# EAGLE schematic Vector Board_Bench 5_04062026 (EAGLE 9.7.0)
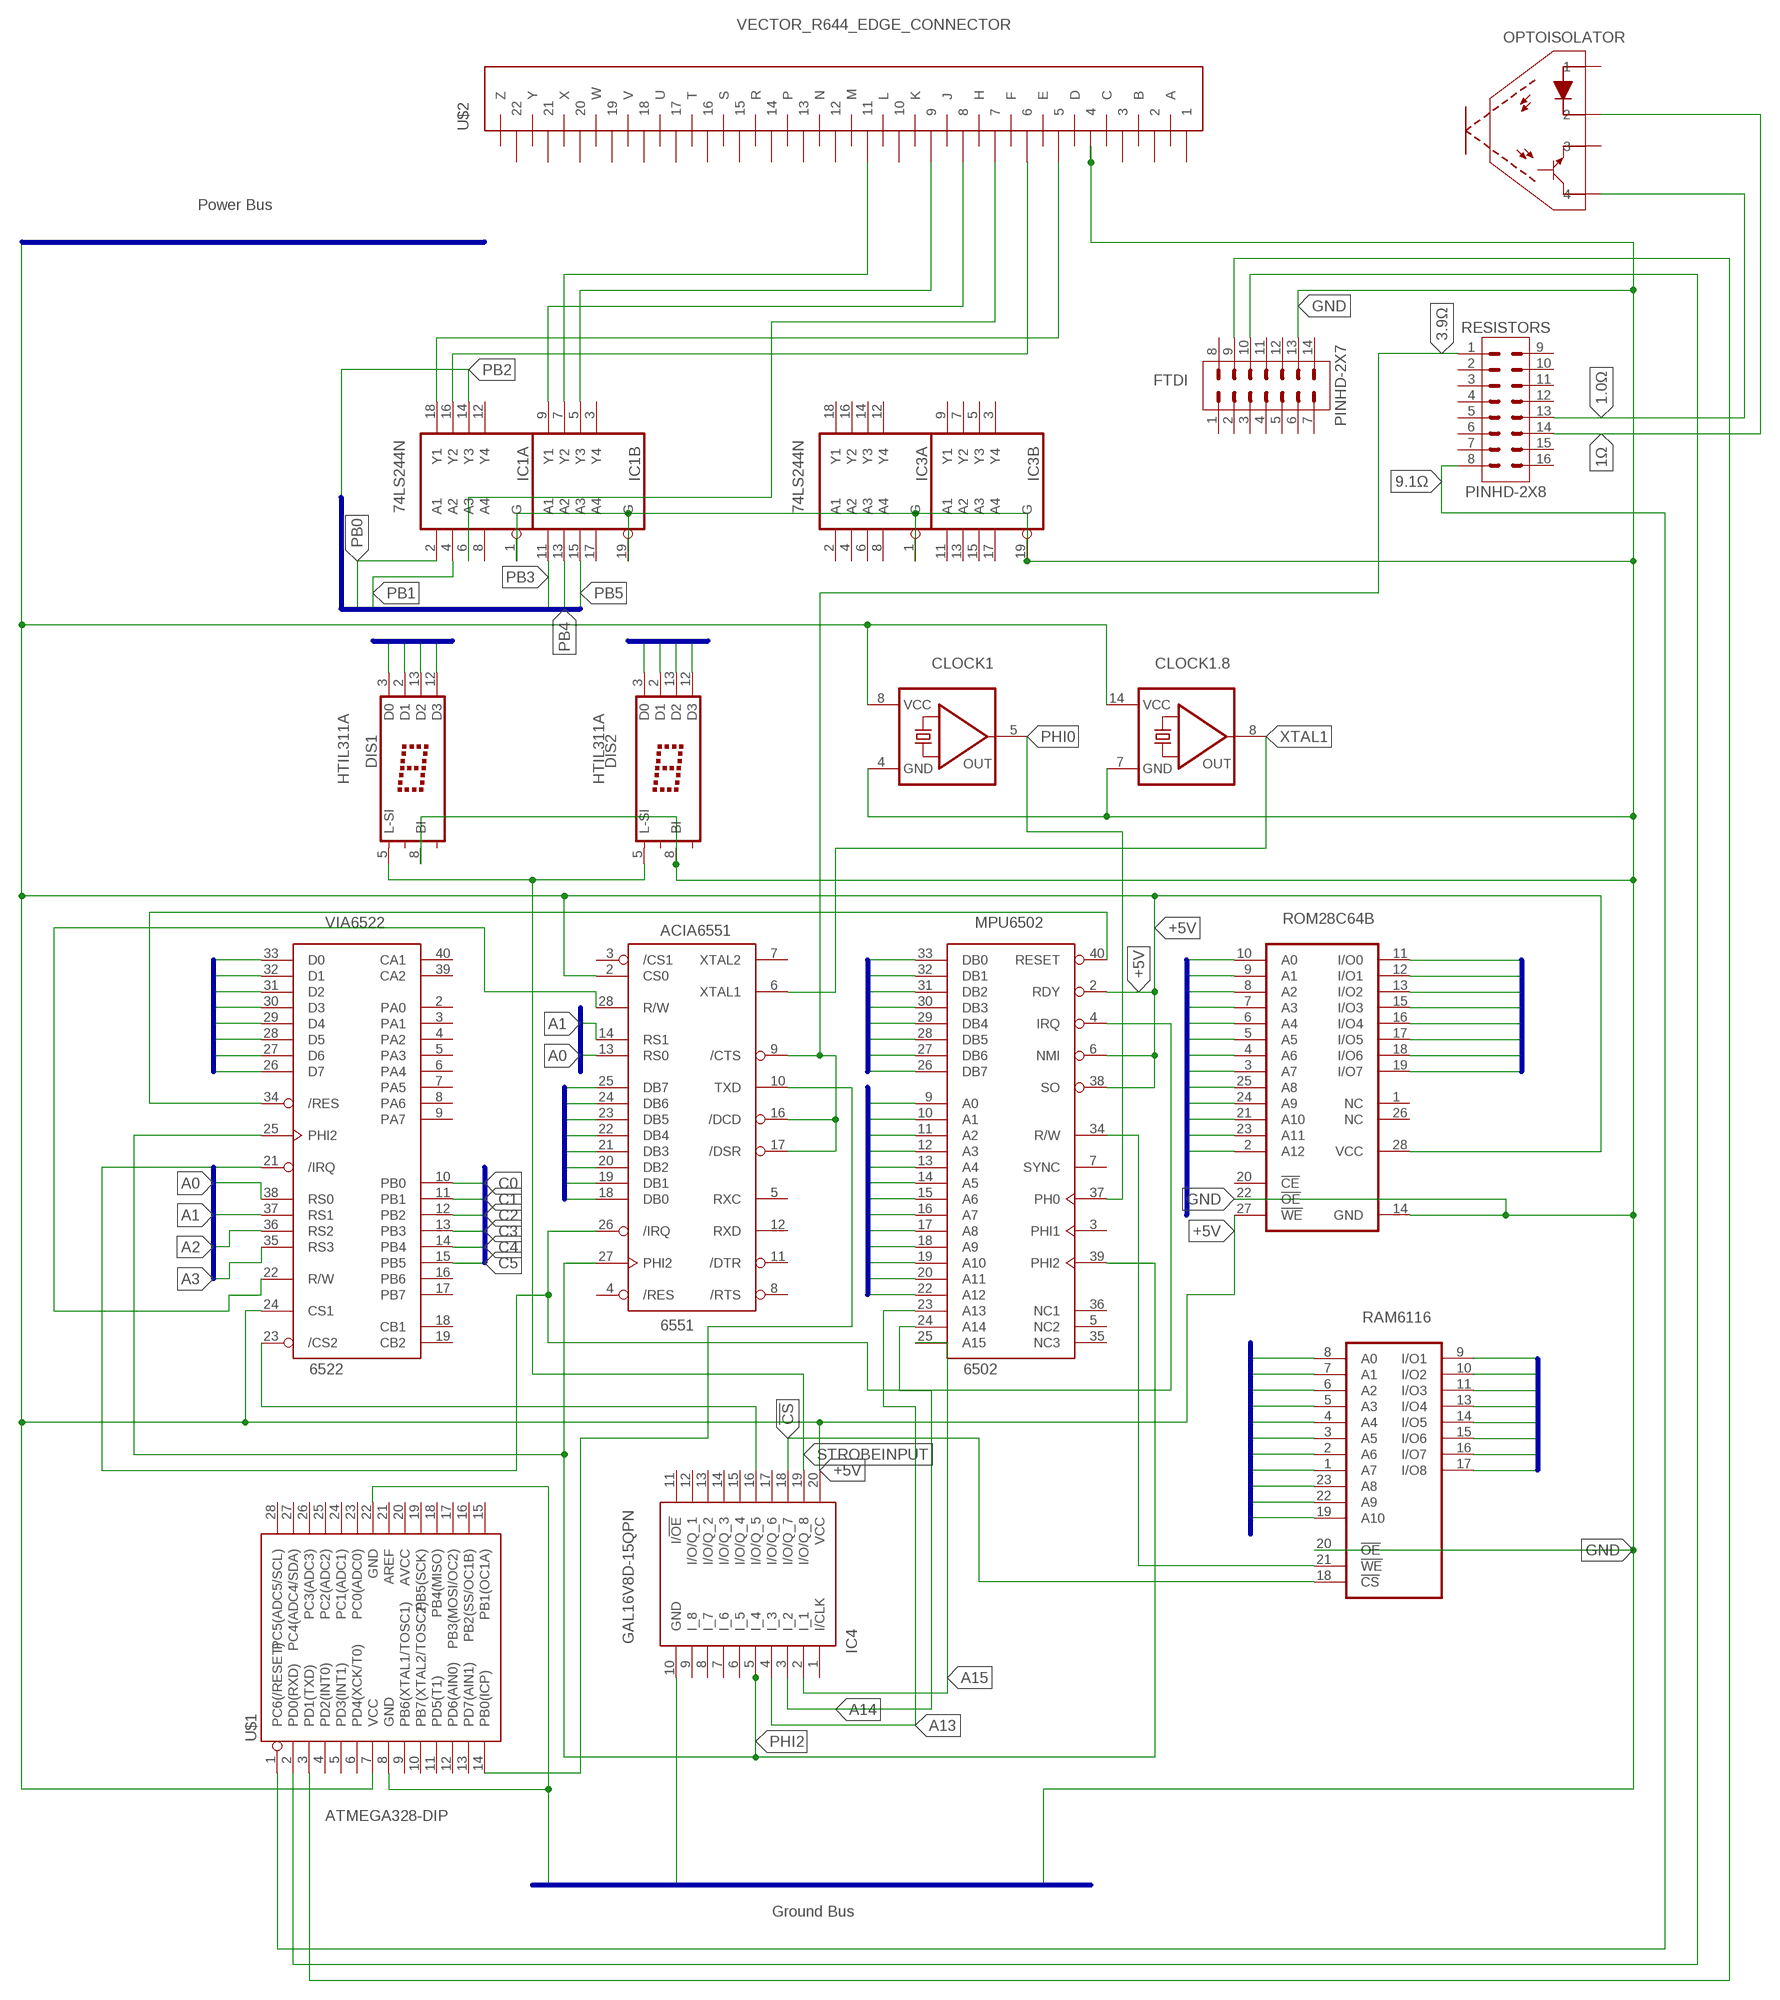
[diagram p0: schematic, sheet 1]

## Parts
ACIA6551  6551  [DIP28]
CLOCK1  QG5460  [DIL08S]
CLOCK1.8  QG5860  [DIL14S]
DIS1  HTIL311A  [HTIL311A]
DIS2  HTIL311A  [HTIL311A]
FTDI  PINHD-2X7  [2X07]
IC1  74LS244N  [DIL20]
IC3  74LS244N  [DIL20]
IC4  GAL16V8D-15QPN  [DIP794W56P254L2591H533Q20N]
MPU6502  6502  [DIP40]
OPTOISOLATOR  OPB7XX_OPTICAL  [OPB7XX_OPTICAL]
RAM6116  6116P  [DIL24-6]
RESISTORS  PINHD-2X8  [2X08]
ROM28C64B  28C64C  [DIL28-6]
U$1  ATMEGA328-DIP  [DIP28]
U$2  VECTOR_R644_EDGE_CONNECTOR  [VECTOR44]
VIA6522  6522  [DIP40]

## Nets
1.0Ω: OPTOISOLATOR.P$4 RESISTORS.13
1Ω: OPTOISOLATOR.P$2 RESISTORS.14
3.9Ω: ACIA6551.9(/CTS) ACIA6551.16(/DCD) ACIA6551.17(/DSR) RESISTORS.1
9.1Ω: RESISTORS.8 U$1.1(PC6(/RESET))
!CS: IC4.18(I/O/Q_7) RAM6116.18(!CS)
+5V: ACIA6551.2(CS0) CLOCK1.8(VCC) CLOCK1.8.14(VCC) IC4.20(VCC) MPU6502.2(RDY) MPU6502.6(NMI) MPU6502.38(SO) ROM28C64B.27(!WE) ROM28C64B.28(VCC) U$1.7(VCC) VIA6522.24(CS1)
A0: ACIA6551.13(RS0) MPU6502.9(A0) RAM6116.8(A0) ROM28C64B.10(A0) VIA6522.38(RS0)
A1: ACIA6551.14(RS1) MPU6502.10(A1) RAM6116.7(A1) ROM28C64B.9(A1) VIA6522.37(RS1)
A2: MPU6502.11(A2) RAM6116.6(A2) ROM28C64B.8(A2) VIA6522.36(RS2)
A3: MPU6502.12(A3) RAM6116.5(A3) ROM28C64B.7(A3) VIA6522.35(RS3)
A4: MPU6502.13(A4) RAM6116.4(A4) ROM28C64B.6(A4)
A5: MPU6502.14(A5) RAM6116.3(A5) ROM28C64B.5(A5)
A6: MPU6502.15(A6) RAM6116.2(A6) ROM28C64B.4(A6)
A7: MPU6502.16(A7) RAM6116.1(A7) ROM28C64B.3(A7)
A8: MPU6502.17(A8) RAM6116.23(A8) ROM28C64B.25(A8)
A9: MPU6502.18(A9) RAM6116.22(A9) ROM28C64B.24(A9)
A10: MPU6502.19(A10) RAM6116.19(A10) ROM28C64B.21(A10)
A11: MPU6502.20(A11) ROM28C64B.23(A11)
A12: MPU6502.22(A12) ROM28C64B.2(A12)
A13: IC4.4(I_3) MPU6502.23(A13)
A14: IC4.3(I_2) MPU6502.24(A14)
A15: IC4.2(I_1) MPU6502.25(A15)
C0: VIA6522.10(PB0)
C1: VIA6522.11(PB1)
C2: VIA6522.12(PB2)
C3: VIA6522.13(PB3)
C4: VIA6522.14(PB4)
C5: VIA6522.15(PB5)
D0: ACIA6551.18(DB0) DIS1.3(D0) MPU6502.33(DB0) RAM6116.9(I/O1) ROM28C64B.11(I/O0) VIA6522.33(D0)
D1: ACIA6551.19(DB1) DIS1.2(D1) MPU6502.32(DB1) RAM6116.10(I/O2) ROM28C64B.12(I/O1) VIA6522.32(D1)
D2: ACIA6551.20(DB2) DIS1.13(D2) MPU6502.31(DB2) RAM6116.11(I/O3) ROM28C64B.13(I/O2) VIA6522.31(D2)
D3: ACIA6551.21(DB3) DIS1.12(D3) DIS2.12(D3) MPU6502.30(DB3) RAM6116.13(I/O4) ROM28C64B.15(I/O3) VIA6522.30(D3)
D4: ACIA6551.22(DB4) DIS2.3(D0) MPU6502.29(DB4) RAM6116.14(I/O5) ROM28C64B.16(I/O4) VIA6522.29(D4)
D5: ACIA6551.23(DB5) DIS2.2(D1) MPU6502.28(DB5) RAM6116.15(I/O6) ROM28C64B.17(I/O5) VIA6522.28(D5)
D6: ACIA6551.24(DB6) DIS2.13(D2) MPU6502.27(DB6) RAM6116.16(I/O7) ROM28C64B.18(I/O6) VIA6522.27(D6)
D7: ACIA6551.25(DB7) MPU6502.26(DB7) RAM6116.17(I/O8) ROM28C64B.19(I/O7) VIA6522.26(D7)
G0: IC4.10(GND)
G1: U$1.8(GND) U$1.22(GND)
GND: CLOCK1.4(GND) CLOCK1.8.7(GND) DIS1.8(BI) DIS2.8(BI) FTDI.13 IC1.1(A:G) IC1.19(B:G) IC3.1(A:G) IC3.19(B:G) RAM6116.20(!OE) ROM28C64B.14(GND) ROM28C64B.22(!OE) U$2.P$4
N$1: IC1.18(A:Y1) U$2.P$5
N$2: IC1.16(A:Y2) U$2.P$6
N$3: IC1.6(A:A3) U$2.P$7
N$4: IC1.9(B:Y1) U$2.P$8
N$5: IC1.5(B:Y3) U$2.P$9
N$6: IC4.16(I/O/Q_5) VIA6522.23(/CS2)
N$7: IC1.7(B:Y2) U$2.P$11
N$17: FTDI.9 U$1.3(PD1(TXD))
N$18: FTDI.10 U$1.2(PD0(RXD))
N$19: ACIA6551.26(/IRQ) MPU6502.4(IRQ) VIA6522.21(/IRQ)
N$20: MPU6502.34(R/W) RAM6116.21(!WE)
N$21: MPU6502.40(RESET) VIA6522.34(/RES)
N$22: ACIA6551.28(R/W) VIA6522.22(R/W)
N$24: ACIA6551.10(TXD) U$1.14(PB0(ICP))
PB0: IC1.2(A:A1)
PB1: IC1.4(A:A2)
PB2: IC1.14(A:Y3)
PB3: IC1.11(B:A1)
PB4: IC1.13(B:A2)
PB5: IC1.15(B:A3)
PHI0: CLOCK1.5(OUT) MPU6502.37(PH0)
PHI2: ACIA6551.27(PHI2) IC4.5(I_4) MPU6502.39(PHI2) VIA6522.25(PHI2)
STROBEINPUT: DIS1.5(L-SI) DIS2.5(L-SI) IC4.19(I/O/Q_8)
XTAL1: ACIA6551.6(XTAL1) CLOCK1.8.8(OUT)
Unconnected: ACIA6551.3(/CS1) ACIA6551.4(/RES) ACIA6551.5(RXC) ACIA6551.7(XTAL2) ACIA6551.8(/RTS) ACIA6551.11(/DTR) ACIA6551.12(RXD) DIS1.1(LEDSUP) DIS2.1(LEDSUP) FTDI.1 FTDI.2 FTDI.3 FTDI.4 FTDI.5 FTDI.6 FTDI.7 FTDI.8 FTDI.11 FTDI.12 FTDI.14 IC1.3(B:Y4) IC1.8(A:A4) IC1.12(A:Y4) IC1.17(B:A4) IC3.2(A:A1) IC3.3(B:Y4) IC3.4(A:A2) IC3.5(B:Y3) IC3.6(A:A3) IC3.7(B:Y2) IC3.8(A:A4) IC3.9(B:Y1) IC3.11(B:A1) IC3.12(A:Y4) IC3.13(B:A2) IC3.14(A:Y3) IC3.15(B:A3) IC3.16(A:Y2) IC3.17(B:A4) IC3.18(A:Y1) IC4.1(I/CLK) IC4.6(I_5) IC4.7(I_6) IC4.8(I_7) IC4.9(I_8) IC4.11(I/!OE) IC4.12(I/O/Q_1) IC4.13(I/O/Q_2) IC4.14(I/O/Q_3) IC4.15(I/O/Q_4) IC4.17(I/O/Q_6) MPU6502.3(PHI1) MPU6502.5(NC2) MPU6502.7(SYNC) MPU6502.35(NC3) MPU6502.36(NC1) OPTOISOLATOR.P$1 OPTOISOLATOR.P$3 RESISTORS.2 RESISTORS.3 RESISTORS.4 RESISTORS.5 RESISTORS.6 RESISTORS.7 RESISTORS.9 RESISTORS.10 RESISTORS.11 RESISTORS.12 RESISTORS.15 RESISTORS.16 ROM28C64B.1(NC) ROM28C64B.20(!CE) ROM28C64B.26(NC) U$1.4(PD2(INT0)) U$1.5(PD3(INT1)) U$1.6(PD4(XCK/T0)) U$1.9(PB6(XTAL1/TOSC1)) U$1.10(PB7(XTAL2/TOSC2)) U$1.11(PD5(T1)) U$1.12(PD6(AIN0)) U$1.13(PD7(AIN1)) U$1.15(PB1(OC1A)) U$1.16(PB2(SS/OC1B)) U$1.17(PB3(MOSI/OC2)) U$1.18(PB4(MISO)) U$1.19(PB5(SCK)) U$1.20(AVCC) U$1.21(AREF) U$1.23(PC0(ADC0)) U$1.24(PC1(ADC1)) U$1.25(PC2(ADC2)) U$1.26(PC3(ADC3)) U$1.27(PC4(ADC4/SDA)) U$1.28(PC5(ADC5/SCL)) U$2.P$1 U$2.P$2 U$2.P$3 U$2.P$10 U$2.P$12 U$2.P$13 U$2.P$14 U$2.P$15 U$2.P$16 U$2.P$17 U$2.P$18 U$2.P$19 U$2.P$20 U$2.P$21 U$2.P$22 U$2.P$A(A) U$2.P$B(B) U$2.P$C(C) U$2.P$D(D) U$2.P$E(E) U$2.P$F(F) U$2.P$H(H) U$2.P$J(J) U$2.P$K(K) U$2.P$L(L) U$2.P$M(M) U$2.P$N(N) U$2.P$P(P) U$2.P$R(R) U$2.P$S(S) U$2.P$T(T) U$2.P$U(U) U$2.P$V(V) U$2.P$W(W) U$2.P$X(X) U$2.P$Y(Y) U$2.P$Z(Z) VIA6522.2(PA0) VIA6522.3(PA1) VIA6522.4(PA2) VIA6522.5(PA3) VIA6522.6(PA4) VIA6522.7(PA5) VIA6522.8(PA6) VIA6522.9(PA7) VIA6522.16(PB6) VIA6522.17(PB7) VIA6522.18(CB1) VIA6522.19(CB2) VIA6522.39(CA2) VIA6522.40(CA1)

## Buses
DATA:D[0..7]
ADDRESS:A[0..15]
POWER:+5V,P[0..15]
GROUND:G[0..15],GND
C[0..5]
PB[0..5]

## Notes on the sheet
- Power Bus
- Ground Bus

## Power pins joined to a net without a drawn wire
GND: ACIA6551.1(GND) DIS1.7(GND) DIS2.7(GND) IC1.10(P:GND) IC3.10(P:GND) MPU6502.1(GND) MPU6502.21(GND) RAM6116.12(GND) VIA6522.1(GND)
VCC: ACIA6551.15(VCC) DIS1.14(VCC) DIS2.14(VCC) IC1.20(P:VCC) IC3.20(P:VCC) MPU6502.8(VCC) RAM6116.24(VCC) VIA6522.20(VCC)

## Library data of the parts
ACIA6551 = MAE412_JDP:6551: ACIA. Capable of RS-232
CLOCK1 = MAE412_JDP:QG5460: CRYSTAL RESONATOR
CLOCK1.8 = MAE412_JDP:QG5860: CRYSTAL RESONATOR
DIS1 DIS2 = JDP_created_v7:HTIL311A: LED DISPLAY 1-character dot matrix, 2 decimal points Internal TTL MSI IC with Latch, Decoder, and Driver Source: http://www.taosinc.com .. til311-e6.pdf
FTDI = Connector:PINHD-2X7: Pin Header
IC1 IC3 = 74xx-us:74*244: Octal BUFFER and LINE DRIVER, 3-state
IC4 = GAL16V8D-15QPN:GAL16V8D-15QPN: SPLD - Simple Programmable Logic Devices 16 Input 8 Output 5V 1/4 Power 15ns Source: Datasheet <https://media.digikey.com/pdf/Data Sheets/Lattice PDFs/GAL16V8.pdf>
MPU6502 = MAE412_JDP:6502: 6502 processor
OPTOISOLATOR = JDP_created_v7:OPB7XX_OPTICAL
RAM6116 = MAE412_JDP:6116P: MEMORY
RESISTORS = Connector:PINHD-2X8: Pin Header
ROM28C64B = MAE412_JDP:28C64C: MEMORY
U$1 = JDP_created_v7:ATMEGA328-DIP
U$2 = JDP_created_v7:VECTOR_R644_EDGE_CONNECTOR
VIA6522 = MAE412_JDP:6522: I/O device: two 8-bits ports, handshake lines, timers.